# EAGLE design soraduino (EAGLE 6.2)
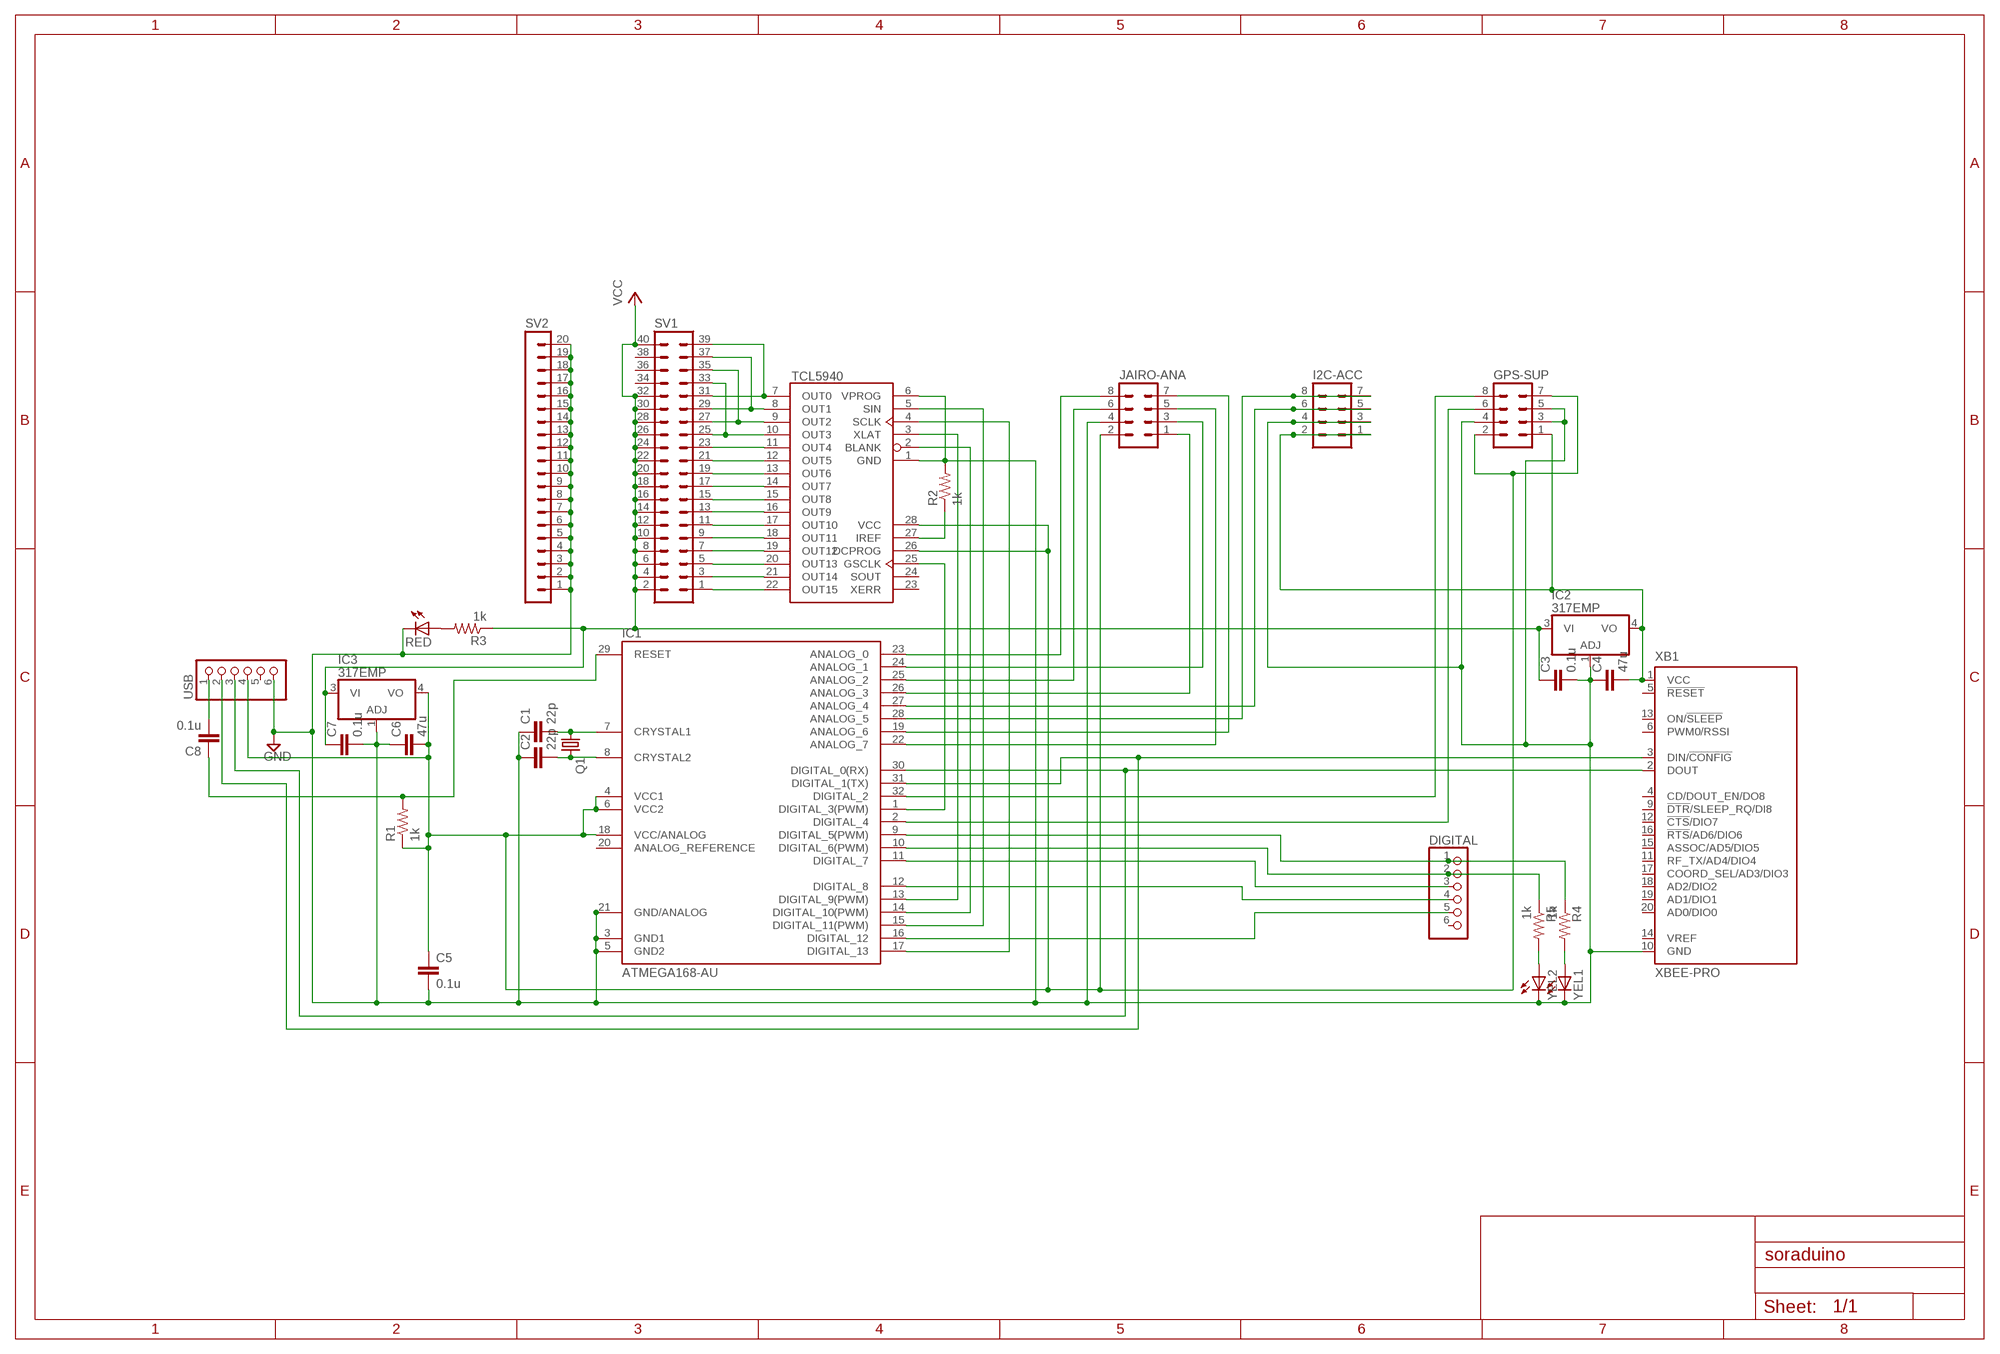
[diagram p0: schematic, sheet 1]

## Parts
C1  22p  C-EU050-024X044  [C050-024X044]
C2  22p  C-EU050-024X044  [C050-024X044]
C3  0.1u  C-EUC0805K  [C0805K]
C4  47u  C-EUC0805K  [C0805K]
C5  0.1u  C-EUC0805K  [C0805K]
C6  47u  C-EUC0805K  [C0805K]
C7  0.1u  C-EUC0805K  [C0805K]
C8  0.1u  C-EUC0805K  [C0805K]
DIGITAL  PINHD-1X6  [1X06]
GPS-SUP  MA04-2  [MA04-2]
I2C-ACC  MA04-2  [MA04-2]
IC1  ATMEGA168-AU  [TQFP32-08]
IC2  317EMP  [SOT223]
IC3  317EMP  [SOT223]
IC4  TCL5940SOP  [HTSSOP28PIN]
JAIRO-ANA  MA04-2  [MA04-2]
Q1  CRYSTALHC49S  [HC49/S]
R1  1k  R-US_R0603  [R0603]
R2  1k  R-US_R0603  [R0603]
R3  1k  R-US_R0603  [R0603]
R4  1k  R-US_R0603  [R0603]
R5  1k  R-US_R0603  [R0603]
RED  LEDCHIPLED_1206  [CHIPLED_1206]
SV1  MA20-2  [MA20-2]
SV2  MA20-1  [MA20-1]
USB  PINHD-1X6  [1X06]
XB1  XBEE-PRO  [XBEE-PRO]
YEL1  LEDCHIPLED_1206  [CHIPLED_1206]
YEL2  LEDCHIPLED_1206  [CHIPLED_1206]

## Nets
GND: C1.1 C2.1 C3.2 C4.1 C5.2 C6.1 C7.2 GPS-SUP.3 GPS-SUP.4 GPS-SUP.5 I2C-ACC.3 I2C-ACC.4 IC1.3(GND1) IC1.5(GND2) IC1.21(GND/ANALOG) IC2.1(ADJ) IC3.1(ADJ) IC4.1(GND) IC4.6(VPROG) JAIRO-ANA.4 R2.2 RED.C SV2.1 SV2.2 SV2.3 SV2.4 SV2.5 SV2.6 SV2.7 SV2.8 SV2.9 SV2.10 SV2.11 SV2.12 SV2.13 SV2.14 SV2.15 SV2.16 SV2.17 SV2.18 SV2.19 SV2.20 USB.6 XB1.10(GND) YEL1.C YEL2.C
N$1: C8.2 USB.1
N$2: C8.1 IC1.29(RESET) R1.2
N$3: IC1.30(DIGITAL_0(RX)) USB.3 XB1.2(DOUT)
N$4: C1.2 IC1.7(CRYSTAL1) Q1.1
N$5: C2.2 IC1.8(CRYSTAL2) Q1.2
N$6: C4.2 GPS-SUP.1 I2C-ACC.1 I2C-ACC.2 IC2.4(VO) XB1.1(VCC)
N$7: C5.1 C6.2 GPS-SUP.2 GPS-SUP.7 IC1.4(VCC1) IC1.6(VCC2) IC1.18(VCC/ANALOG) IC3.4(VO) IC4.26(DCPROG) IC4.28(VCC) JAIRO-ANA.2 R1.1 USB.4
N$8: IC4.8(OUT1) SV1.29 SV1.37
N$9: IC4.7(OUT0) SV1.31 SV1.39
N$10: R3.2 RED.A
N$11: IC4.9(OUT2) SV1.27 SV1.35
N$12: IC4.10(OUT3) SV1.25 SV1.33
N$13: IC4.11(OUT4) SV1.23
N$14: IC4.12(OUT5) SV1.21
N$15: IC4.13(OUT6) SV1.19
N$16: IC4.14(OUT7) SV1.17
N$17: IC4.15(OUT8) SV1.15
N$18: IC4.16(OUT9) SV1.13
N$19: IC4.17(OUT10) SV1.11
N$20: IC4.18(OUT11) SV1.9
N$21: IC4.19(OUT12) SV1.7
N$22: IC4.20(OUT13) SV1.5
N$23: IC4.21(OUT14) SV1.3
N$24: IC4.22(OUT15) SV1.1
N$25: IC1.25(ANALOG_2) JAIRO-ANA.6
N$26: IC1.1(DIGITAL_3(PWM)) IC4.25(GSCLK)
N$27: IC1.13(DIGITAL_9(PWM)) IC4.3(XLAT)
N$28: IC1.14(DIGITAL_10(PWM)) IC4.2(BLANK)
N$29: IC1.15(DIGITAL_11(PWM)) IC4.5(SIN)
N$30: IC1.17(DIGITAL_13) IC4.4(SCLK)
N$31: I2C-ACC.7 I2C-ACC.8 IC1.28(ANALOG_5)
N$32: I2C-ACC.5 I2C-ACC.6 IC1.27(ANALOG_4)
N$33: IC1.31(DIGITAL_1(TX)) USB.2 XB1.3(DIN/!CONFIG)
N$34: IC1.23(ANALOG_0) JAIRO-ANA.8
N$35: IC1.24(ANALOG_1) JAIRO-ANA.3
N$36: GPS-SUP.8 IC1.32(DIGITAL_2)
N$37: GPS-SUP.6 IC1.2(DIGITAL_4)
N$38: IC4.27(IREF) R2.1
N$39: DIGITAL.1 IC1.9(DIGITAL_5(PWM)) R4.1
N$40: DIGITAL.2 IC1.10(DIGITAL_6(PWM)) R5.1
N$41: DIGITAL.3 IC1.11(DIGITAL_7)
N$42: DIGITAL.4 IC1.12(DIGITAL_8)
N$43: IC1.26(ANALOG_3) JAIRO-ANA.1
N$44: IC1.19(ANALOG_6) JAIRO-ANA.7
N$45: IC1.22(ANALOG_7) JAIRO-ANA.5
N$46: R4.2 YEL1.A
N$47: DIGITAL.5 IC1.16(DIGITAL_12)
N$48: R5.2 YEL2.A
VCC: C3.1 C7.1 IC2.3(VI) IC3.3(VI) R3.1 SV1.2 SV1.4 SV1.6 SV1.8 SV1.10 SV1.12 SV1.14 SV1.16 SV1.18 SV1.20 SV1.22 SV1.24 SV1.26 SV1.28 SV1.30 SV1.32 SV1.40
Unconnected: DIGITAL.6 IC1.20(ANALOG_REFERENCE) IC4.23(XERR) IC4.24(SOUT) SV1.34 SV1.36 SV1.38 USB.5 XB1.4(CD/DOUT_EN/DO8) XB1.5(!RESET) XB1.6(PWM0/RSSI) XB1.9(!DTR!/SLEEP_RQ/DI8) XB1.11(RF_TX/AD4/DIO4) XB1.12(!CTS!/DIO7) XB1.13(ON/!SLEEP) XB1.14(VREF) XB1.15(ASSOC/AD5/DIO5) XB1.16(!RTS!/AD6/DIO6) XB1.17(COORD_SEL/AD3/DIO3) XB1.18(AD2/DIO2) XB1.19(AD1/DIO1) XB1.20(AD0/DIO0)

## Library data of the parts
C1 C2 = rcl:C-EU: CAPACITOR, European symbol
C3-C8 = resistor:C-EU: CAPACITOR, European symbol
DIGITAL USB = pinhead:PINHD-1X6: PIN HEADER
GPS-SUP I2C-ACC JAIRO-ANA = con-lstb:MA04-2: PIN HEADER; OC_FARNELL: unknown; OC_NEWARK: unknown
IC1 = Arduino-AVR:ATMEGA168
IC2 IC3 = linear:*317: Positive VOLTAGE REGULATOR
IC4 = tcl5940PWP:TCL5940: 16-Channel 12-Bit LED Driver
Q1 = crystal:CRYSTAL: CRYSTAL; OC_FARNELL: 1667008; OC_NEWARK: unknown
R1-R5 = rcl:R-US_: RESISTOR, American symbol
RED YEL1 YEL2 = led:LED: LED OSRAM: - CHIPLED LG R971, LG N971, LY N971, LG Q971, LY Q971, LO R971, LY R971 LH N974, LH R974 LS Q976, LO Q976, LY Q976 LO Q996 - Hyper CHIPLED LW Q18S LB Q993, LB Q99A, LB R99A - SideLED LS A670, LO A670, LY A670, LG A670, LP A670 LB A673, LV A673, LT A673, LW A673 LH A674 LY A675 LS A676, LA A676, LO A676, LY A676, LW A676 LS A679, LY A679, LG A679 - Hyper Micro SIDELED® LS Y876, LA Y876, LO Y876, LY Y876 LT Y87S - SmartLED LW L88C, LW L88S LB L89C, LB L89S, LG L890 LS L89K, LO L89K, LY L89K LS L896, LA L896, LO L896, LY L896 - TOPLED LS T670, LO T670, LY T670, LG T670, LP T670 LSG T670, LSP T670, LSY T670, LOP T670, LYG T670 LG T671, LOG T671, LSG T671 LB T673, LV T673, LT T673, LW T673 LH T674 LS T676, LA T676, LO T676, LY T676, LB T676, LH T676, LSB T676, LW T676 LB T67C, LV T67C, LT T67C, LS T67K, LO T67K, LY T67K, LW E67C LS E67B, LA E67B, LO E67B, LY E67B, LB E67C, LV E67C, LT E67C LW T67C LS T679, LY T679, LG T679 LS T770, LO T770, LY T770, LG T770, LP T770 LB T773, LV T773, LT T773, LW T773 LH T774 LS E675, LA E675, LY E675, LS T675 LS T776, LA T776, LO T776, LY T776, LB T776 LHGB T686 LT T68C, LB T68C - Hyper Mini TOPLED® LB M676 - Mini TOPLED Santana® LG M470 LS M47K, LO M47K, LY M47K Source: http://www.osram.convergy.de LUXEON: - LUMILED® LXK2-PW12-R00, LXK2-PW12-S00, LXK2-PW14-U00, LXK2-PW14-V00 LXK2-PM12-R00, LXK2-PM12-S00, LXK2-PM14-U00 LXK2-PE12-Q00, LXK2-PE12-R00, LXK2-PE12-S00, LXK2-PE14-T00, LXK2-PE14-U00 LXK2-PB12-K00, LXK2-PB12-L00, LXK2-PB12-M00, LXK2-PB14-N00, LXK2-PB14-P00, LXK2-PB14-Q00 LXK2-PR12-L00, LXK2-PR12-M00, LXK2-PR14-Q00, LXK2-PR14-R00 LXK2-PD12-Q00, LXK2-PD12-R00, LXK2-PD12-S00 LXK2-PH12-R00, LXK2-PH12-S00 LXK2-PL12-P00, LXK2-PL12-Q00, LXK2-PL12-R00 Source: www.luxeon.com KINGBRIGHT: KA-3528ASYC Source: www.kingbright.com
SV1 = con-lstb:MA20-2: PIN HEADER; OC_FARNELL: unknown; OC_NEWARK: unknown
SV2 = con-lstb:MA20-1: PIN HEADER; OC_FARNELL: unknown; OC_NEWARK: unknown
XB1 = maxstream:XBEE: XBee (TM) /XBee-PRO(TM) OEM RF Modules Source: MaxStream, Inc. xbee_productmanual.pdf; MPN: XBP24-AWI-001; OC_FARNELL: 1337916; OC_NEWARK: 42M2667

## Board
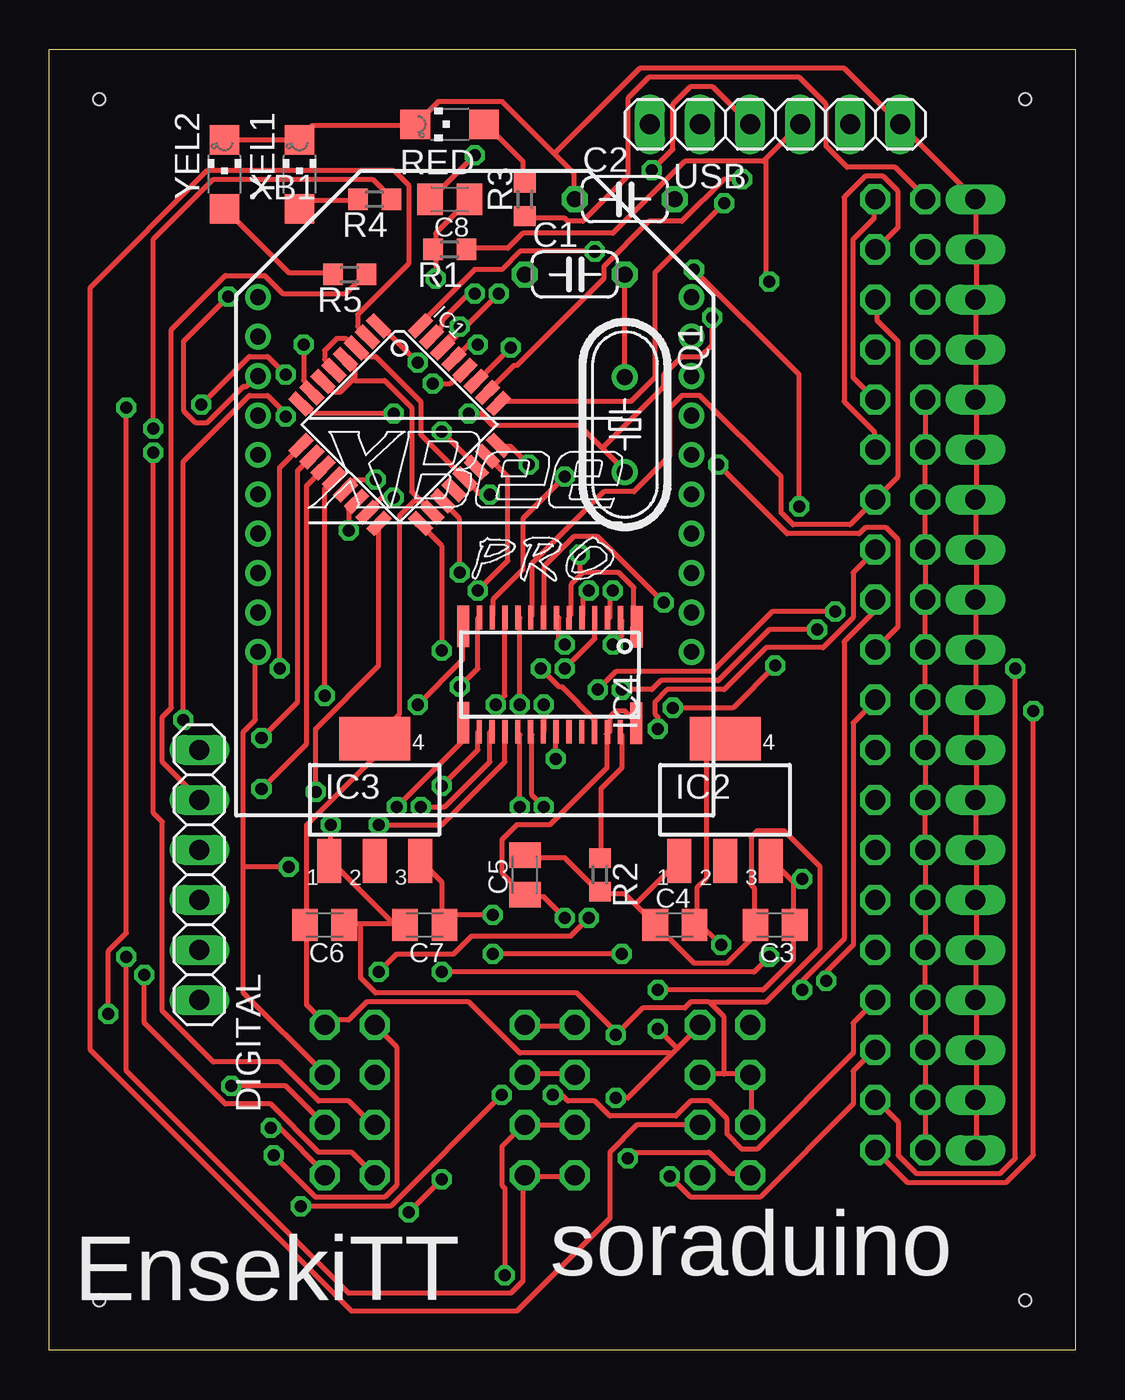
[diagram p1: board, top side]
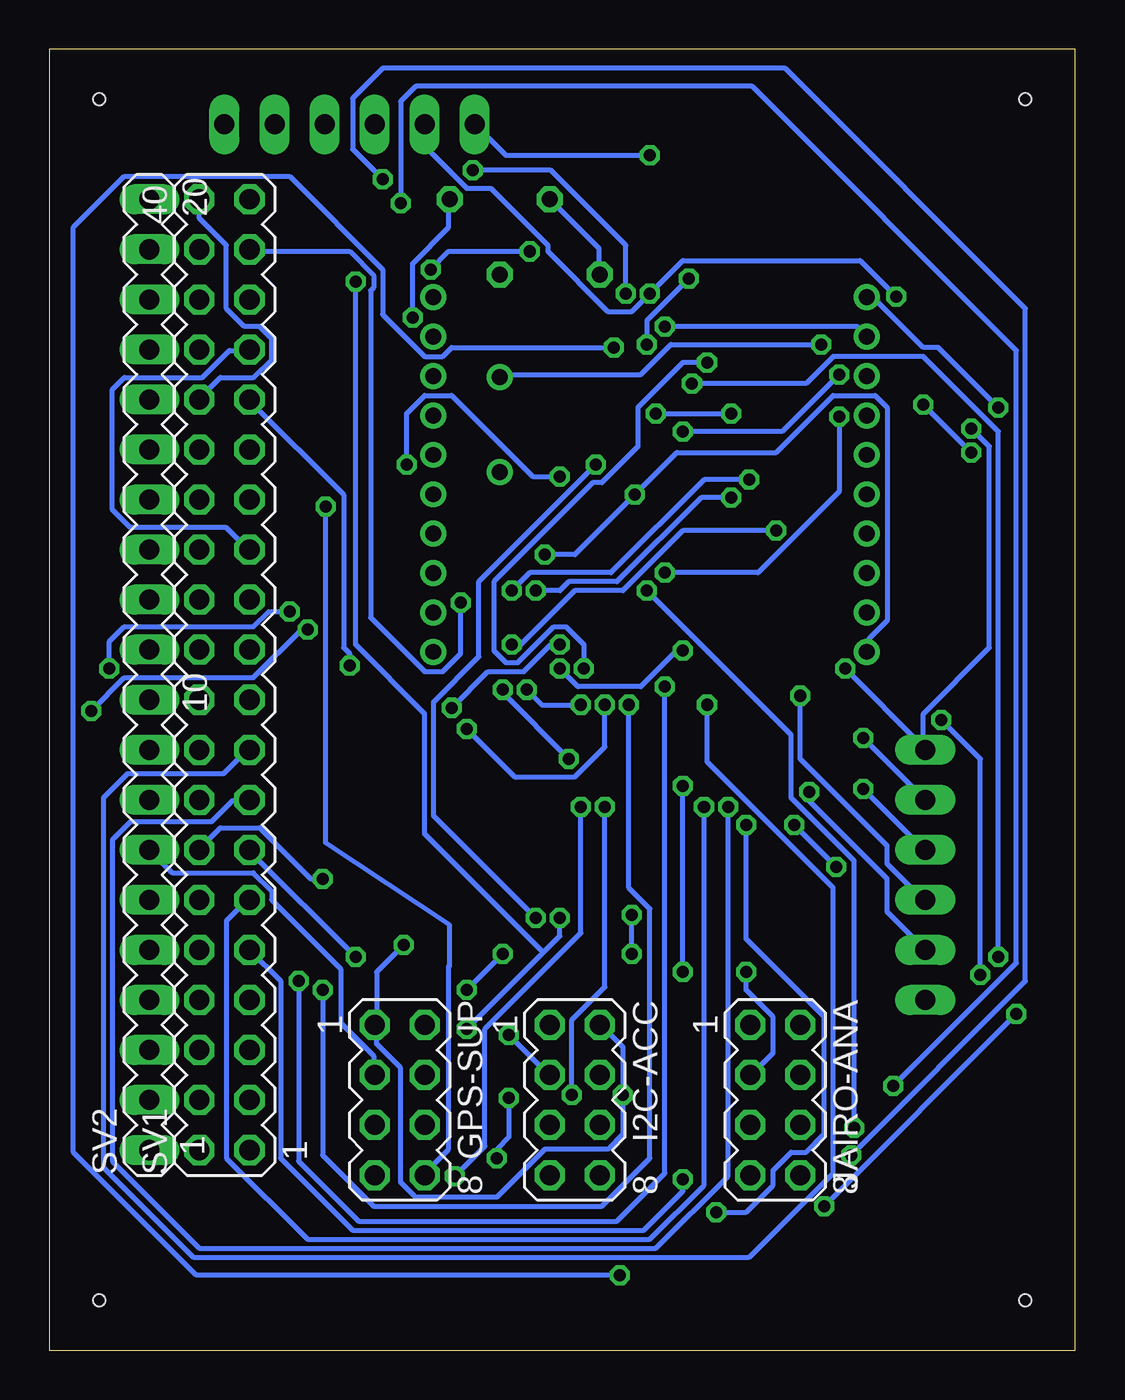
[diagram p2: board, bottom side, seen from below]

Size 52.07 x 66.04 mm. Coordinates in mm from the lower left corner, seen from the top.
Outline: 0,66.04 52.07,66.04 52.07,0 0,0 0,66.04
Copper layers (1*16): Top 0.035mm / dielectric 1.5mm / Bottom 0.035mm
Design rules: minimum track width 10mil, minimum drill 24mil, track to track 8mil, track to pad 8mil, pad to pad 8mil, via to via 8mil, smd to smd 8mil, copper to edge 40mil, drill to drill 8mil, minimum pad ring 10mil, minimum via ring 8mil, stop-mask expansion 4mil, vias tented up to drill 0mil, thermal gap 10mil
Holes 0.6 mm at 2.54,63.5 49.53,63.5 49.53,2.54 2.54,2.54

### Footprints (pad centres in the part's own frame; a part is rotated, then mirrored left to right if it is on the bottom)
C050-024X044 = drill 0.813 octagon: 1 -2.54,0; 2 2.54,0
C0805K = smd 1.3 x 1.6: 1 -1,0; 2 1,0
1X06 = drill 1.016 long: 1 -6.35,0; 2 -3.81,0; 3 -1.27,0; 4 1.27,0; 5 3.81,0; 6 6.35,0
MA04-2 = drill 1.016 octagon: 1 -3.81,-1.27; 2 -3.81,1.27; 3 -1.27,-1.27; 4 -1.27,1.27; 5 1.27,-1.27; 6 1.27,1.27; 7 3.81,-1.27; 8 3.81,1.27
TQFP32-08 = smd 1.27 x 0.559: 1 -4.293,2.8; 2 -4.293,2; 3 -4.293,1.2; 4 -4.293,0.4; 5 -4.293,-0.4; 6 -4.293,-1.2; 7 -4.293,-2; 8 -4.293,-2.8; 17 4.293,-2.8; 18 4.293,-2; 19 4.293,-1.2; 20 4.293,-0.4; 21 4.293,0.4; 22 4.293,1.2; 23 4.293,2; 24 4.293,2.8 | smd 0.559 x 1.27: 9 -2.8,-4.293; 10 -2,-4.293; 11 -1.2,-4.293; 12 -0.4,-4.293; 13 0.4,-4.293; 14 1.2,-4.293; 15 2,-4.293; 16 2.8,-4.293; 25 2.8,4.293; 26 2,4.293; 27 1.2,4.293; 28 0.4,4.293; 29 -0.4,4.293; 30 -1.2,4.293; 31 -2,4.293; 32 -2.8,4.293
SOT223 = smd 1.219 x 2.235: 1 -2.311,-3.099; 2 0,-3.099; 3 2.311,-3.099 | smd 3.6 x 2.2: 4 0,3.099
HTSSOP28PIN = smd 0.61 x 2.1: 1 -4.395,-2.45; 14 4.395,-2.45; 15 4.395,2.45; 28 -4.395,2.45 | smd 0.27 x 1.2: 2 -3.575,-2.9; 3 -2.925,-2.9; 4 -2.275,-2.9; 5 -1.625,-2.9; 6 -0.975,-2.9; 7 -0.325,-2.9; 8 0.325,-2.9; 9 0.975,-2.9; 10 1.625,-2.9; 11 2.275,-2.9; 12 2.925,-2.9; 13 3.575,-2.9; 16 3.575,2.9; 17 2.925,2.9; 18 2.275,2.9; 19 1.625,2.9; 20 0.975,2.9; 21 0.325,2.9; 22 -0.325,2.9; 23 -0.975,2.9; 24 -1.625,2.9; 25 -2.275,2.9; 26 -2.925,2.9; 27 -3.575,2.9
HC49/S = drill 0.813: 1 -2.413,0; 2 2.413,0
R0603 = smd 1 x 1.1: 1 -0.85,0; 2 0.85,0
CHIPLED_1206 = smd 1.5 x 1.5: A 0,-1.75; C 0,1.75
MA20-2 = drill 1.016 octagon: 1 -24.13,-1.27; 2 -24.13,1.27; 3 -21.59,-1.27; 4 -21.59,1.27; 5 -19.05,-1.27; 6 -19.05,1.27; 7 -16.51,-1.27; 8 -16.51,1.27; 9 -13.97,-1.27; 10 -13.97,1.27; 11 -11.43,-1.27; 12 -11.43,1.27; 13 -8.89,-1.27; 14 -8.89,1.27; 15 -6.35,-1.27; 16 -6.35,1.27; 17 -3.81,-1.27; 18 -3.81,1.27; 19 -1.27,-1.27; 20 -1.27,1.27; 21 1.27,-1.27; 22 1.27,1.27; 23 3.81,-1.27; 24 3.81,1.27; 25 6.35,-1.27; 26 6.35,1.27; 27 8.89,-1.27; 28 8.89,1.27; 29 11.43,-1.27; 30 11.43,1.27; 31 13.97,-1.27; 32 13.97,1.27; 33 16.51,-1.27; 34 16.51,1.27; 35 19.05,-1.27; 36 19.05,1.27; 37 21.59,-1.27; 38 21.59,1.27; 39 24.13,-1.27; 40 24.13,1.27
MA20-1 = drill 1.016 long: 1 -24.13,0; 2 -21.59,0; 3 -19.05,0; 4 -16.51,0; 5 -13.97,0; 6 -11.43,0; 7 -8.89,0; 8 -6.35,0; 9 -3.81,0; 10 -1.27,0; 11 1.27,0; 12 3.81,0; 13 6.35,0; 14 8.89,0; 15 11.43,0; 16 13.97,0; 17 16.51,0; 18 19.05,0; 19 21.59,0; 20 24.13,0
XBEE-PRO = drill 0.8 pad 1.27: 1 -11,9; 2 -11,7; 3 -11,5; 4 -11,3; 5 -11,1; 6 -11,-1; 7 -11,-3; 8 -11,-5; 9 -11,-7; 10 -11,-9; 11 11,-9; 12 11,-7; 13 11,-5; 14 11,-3; 15 11,-1; 16 11,1; 17 11,3; 18 11,5; 19 11,7; 20 11,9

### Placement (x,y rotation side)
C1  26.67,54.61 0 top
C2  29.21,58.42 0 top
C3  36.83,21.59 180 top
C4  31.75,21.59 0 top
C5  24.13,24.13 90 top
C6  13.97,21.59 180 top
C7  19.05,21.59 180 top
C8  20.32,58.42 180 top
DIGITAL  7.62,24.13 270 top
GPS-SUP  34.29,12.7 270 bottom
I2C-ACC  25.4,12.7 270 bottom
IC1  17.78,46.99 315.1 top
IC2  34.29,27.94 0 top
IC3  16.51,27.94 0 top
IC4  25.4,34.29 179.9 top
JAIRO-ANA  15.24,12.7 270 bottom
Q1  29.21,46.99 270 top
R1  20.32,55.88 180 top
R2  27.94,24.13 270 top
R3  24.13,58.42 90 top
R4  16.51,58.42 180 top
R5  15.24,54.61 180 top
RED  20.32,62.23 90 top
SV1  43.18,34.29 90 bottom
SV2  46.99,34.29 90 bottom
USB  36.83,62.23 0 top
XB1  21.59,44.45 0 top
YEL1  12.7,59.69 0 top
YEL2  8.89,59.69 0 top

### Tracks (layer width: path | path; a pad name or v marks a point on that pad's centre or on a via)
GND  (via drill 0.61)
  Top 0.254: 9.86,24.54 9.86,18.14 13.97,14.02 JAIRO-ANA.4 | 9.86,24.54 9.86,31.39 10.47,32 10.47,35.36 XB1.10 | 27,39.39 27.08,39.47 28.91,39.47 29.67,38.71 29.67,36.88 IC4.1 | 27,39.39 26.47,38.86 26.47,37.34 IC4.6 | IC1.5 14.43,49.84 13.97,50.29 13.97,50.75 14.58,51.36 15.04,51.36 15.49,50.9 IC1.3 15.65,50.75 15.95,50.44 16.56,50.44 18.85,48.16 18.85,46.48 20.98,44.35 IC1.21 21.13,44.2 21.89,43.43 v22.35,43.43 | v26.92,40.39 26.92,39.47 27,39.39 | 29.74,22.63 30.73,21.64 C4.1 32.16,20.22 32.72,19.66 34.39,19.66 35.76,21.03 35.76,21.49 C3.2 35.76,21.64 35.76,23.47 35.61,23.62 35.61,26.06 35.92,26.36 37.29,26.36 39.12,24.54 39.12,20.42 36.37,17.68 33.63,17.68 33.55,17.6 | 29.74,22.63 29.21,23.17 27.99,23.17 R2.2 27.84,23.32 26.16,24.99 24.18,24.99 C5.2 | 29.74,22.63 31.95,24.84 IC2.1 | 17.47,21.64 17.93,21.64 C7.2 17.47,21.64 | 17.47,21.64 15.8,21.64 | 15.8,21.64 15.04,21.64 C6.1 | 17.47,21.64 14.28,24.84 | I2C-ACC.4 24.18,14.02 26.62,14.02 I2C-ACC.3 | 34.24,14.02 35.46,14.02 GPS-SUP.3 35.61,13.87 35.61,11.43 GPS-SUP.5 | 34.24,14.02 33.02,14.02 GPS-SUP.4 | 33.55,17.6 34.24,16.92 34.24,14.02 | 33.55,17.6 33.48,17.68 32.56,17.68 32.26,17.37 30.12,17.37 v28.75,16 28.75,16.15 26.77,18.14 16.56,18.14 15.8,18.9 15.8,21.64 | YEL2.C 8.94,61.42 12.6,61.42 YEL1.C 12.75,61.57 13.36,62.18 18.54,62.18 RED.C 18.69,62.33 19.76,63.4 22.96,63.4 25.63,60.73 | 25.63,60.73 26.62,59.74 26.62,58.52 C2.1 | 47.04,53.34 47.04,55.78 SV2.19 47.04,55.93 47.04,58.37 SV2.20 USB.6 40.33,65.08 29.97,65.08 25.63,60.73 | 47.04,38.1 47.04,40.54 SV2.13 47.04,40.69 47.04,43.13 SV2.14 47.04,43.28 47.04,45.72
  Top 0.254: 47.04,45.72 47.04,48.16 SV2.16 47.04,48.31 47.04,50.75 SV2.17 47.04,50.9 47.04,53.34 | 47.04,45.72 SV2.15 | SV2.1 47.04,10.21 47.04,12.65 SV2.2 47.04,12.8 47.04,15.24 | 47.04,15.24 47.04,17.68 SV2.4 47.04,17.83 47.04,20.27 SV2.5 47.04,20.42 47.04,22.86 | 47.04,15.24 SV2.3 | 47.04,22.86 47.04,25.3 SV2.7 47.04,25.45 47.04,27.89 SV2.8 47.04,28.04 47.04,30.48 | 47.04,30.48 47.04,32.92 SV2.10 47.04,33.07 47.04,35.51 SV2.11 47.04,35.66 47.04,38.1 | 47.04,30.48 SV2.9 | 47.04,22.86 SV2.6 | 47.04,38.1 SV2.12 | 47.04,53.34 SV2.18 | v12.14,24.54 9.86,24.54 | 14.28,24.84 v14.28,26.67 | 14.28,24.84 IC3.1
  Bottom 0.254: v26.92,40.39 25.4,40.39 v22.35,43.43 20.22,45.57 15.19,45.57 12.29,48.46 10.16,48.46 9.55,47.85 9.55,37.03 10.47,36.12 10.47,35.51 XB1.10 | v28.75,16 26.77,14.02 I2C-ACC.3 | C2.1 24.18,55.93 24.18,54.71 C1.1 | SV2.7 45.82,24.23 41.71,24.23 40.79,23.32 40.79,22.86 37.29,19.36 37.29,16.61 35.61,14.93 35.61,14.02 GPS-SUP.3 | v14.28,26.67 v12.14,24.54
N$1  (via drill 0.61)
  Top 0.254: v21.59,60.66 19.46,58.52 C8.2
  Bottom 0.254: v21.59,60.66 28.91,60.66 USB.1
N$2  (via drill 0.61)
  Top 0.254: C8.1 21.28,58.37 19.61,56.69 19.61,55.93 R1.2 19.61,55.78 v19.61,54.41 | v21.74,51.05 21.28,51.05 20.68,50.44 IC1.29
  Bottom 0.254: v21.74,51.05 21.74,52.27 v19.61,54.41
N$3  (via drill 0.61)
  Top 0.254: 20.07,50.9 20.07,51.21 v20.83,51.97 | USB.3 33.63,64.16 32.56,64.16 31.65,63.25 31.65,60.96 v30.58,59.89 | 20.07,50.9 v22.81,53.64 | 20.07,50.9 IC1.30
  Bottom 0.254: v20.83,51.97 11.07,51.97 10.62,51.51 XB1.2 | v30.58,59.89 26.62,59.89 22.81,56.08 v22.81,53.64
N$4  (via drill 0.61)
  Top 0.254: v12.9,51.05 12.9,49.23 13.21,48.92 13.21,48.62 IC1.7 | Q1.1 C1.2
  Bottom 0.254: v12.9,51.05 20.52,51.05 22.05,49.53 29.21,49.53 Q1.1
N$5  (via drill 0.61)
  Top 0.254: v17.47,47.55 13.36,47.55 12.9,48.01 IC1.8 | v21.28,47.55 21.89,47.55 22.5,46.94 26.92,46.94 28.07,45.8 | 28.07,45.8 29.21,44.65 Q1.2 | v33.63,52.43 33.63,51.05 33.02,50.44 32.11,50.44 31.19,49.53 31.19,48.92 28.07,45.8
  Bottom 0.254: v21.28,47.55 v17.47,47.55 | v33.63,52.43 33.63,55.17 31.8,57 31.8,58.37 C2.2
N$6  (via drill 0.61)
  Top 0.254: 32.87,21.79 32.87,23.47 33.33,23.93 33.33,30.02 34.24,30.94 IC2.4 | 32.87,21.79 32.87,21.64 C4.2 32.87,21.79 | 32.87,21.79 v34.09,20.57 | v3.91,47.85 3.91,21.18 3,20.27 v3,17.07 | v12.75,7.31 17.32,7.31 v22.96,12.95 | I2C-ACC.1 26.62,16.46 24.18,16.46 I2C-ACC.2
  Bottom 0.254: v34.09,20.57 35.46,19.2 35.46,16.61 GPS-SUP.1 35.46,16.46 35.46,15.54 34.24,14.33 34.24,8.53 33.48,7.77 29.36,7.77 26.92,10.21 23.72,10.21 22.96,10.97 v22.96,12.95 22.96,15.39 24.03,16.46 I2C-ACC.2 | v3.91,47.85 6.96,50.9 7.72,50.9 10.16,53.34 10.47,53.34 XB1.1 | v12.75,7.31 v3,17.07
N$7  (via drill 0.61)
  Top 0.254: 15.42,49.3 15.49,49.38 15.49,49.84 15.04,50.29 IC1.4 | 15.42,49.3 14.73,48.62 14.43,48.62 13.97,49.07 IC1.6 | 18.77,43.2 18.39,43.59 18.39,47.85 17.02,49.23 15.49,49.23 15.42,49.3 | 18.77,43.2 19.3,42.67 IC1.18 | 18.77,43.2 18.69,43.13 18.54,43.13 17.78,42.37 17.78,32.31 16.56,31.09 IC3.4 16.41,30.94 16.41,30.02 13.06,26.67 13.06,21.64 C6.2 13.06,21.49 13.06,17.53 13.97,16.61 JAIRO-ANA.2 13.97,16.76 15.19,16.76 16.1,17.68 21.28,17.68 23.88,15.09 31.5,15.09 31.57,15.01 | USB.4 36.3,60.43 | 36.3,60.43 36.22,60.35 32.26,60.35 28.6,56.69 24.03,56.69 23.27,55.93 21.28,55.93 R1.1 | IC4.28 29.82,31.85 29.21,32.46 28.75,32.46 28.45,32.16 28.45,31.39 IC4.26 28.3,31.24 28.3,29.57 25.4,26.67 23.72,26.67 22.96,25.91 22.96,24.23 24.03,23.17 C5.1 24.18,23.01 25.09,23.01 v26.16,21.95 | v29.36,9.75 29.67,10.06 33.48,10.06 34.54,8.99 35.46,8.99 GPS-SUP.7 | v28.75,12.8 29.36,12.8 31.57,15.01 | 31.88,15.32 33.02,16.46 GPS-SUP.2 | 31.88,15.32 31.57,15.01 | 31.88,15.32 v30.89,16.31 | v36.53,54.25 36.37,54.41 36.37,60.35 36.3,60.43
  Bottom 0.254: v29.36,9.75 29.36,10.21 28.75,10.82 v28.75,12.8 | v26.16,21.95 26.16,21.03 27,20.19 | v30.89,16.31 27,20.19 | v36.53,54.25 36.53,35.81 33.02,32.31 33.02,26.21 27,20.19
N$8  (via drill 0.61)
  Top 0.254: v31.19,37.95 27.84,41.3 26.62,41.3 25.09,39.78 25.09,37.34 IC4.8 | SV1.29 41.86,45.72 41.86,46.63 40.33,48.16 40.33,58.52 41.4,59.59 42.32,59.59 43.08,58.83 43.08,57 42.01,55.93 SV1.37
  Bottom 0.254: v31.19,37.95 31.19,35.36 32.11,34.44 33.02,34.44 35.76,37.19 35.76,53.8 35.61,53.95 35.61,54.56 36.83,55.78 41.86,55.78 SV1.37
N$9  (via drill 0.61)
  Top 0.254: v26.16,35.81 25.86,36.12 25.86,37.19 IC4.7 | v31.65,32.61 34.7,32.61 v36.83,34.75 | SV1.31 40.79,49.38 40.79,56.39 41.86,57.45 41.86,58.37 SV1.39
  Bottom 0.254: v26.16,35.81 26.62,35.81 27.99,34.44 29.82,34.44 v31.65,32.61 | v36.83,34.75 36.83,35.36 37.14,35.66 37.14,43.43 41.86,48.16 SV1.31
N$10
  Top 0.254: R3.2 24.03,59.28 24.03,60.35 22.2,62.18 RED.A
N$11
  Top 0.254: IC4.9 24.49,37.34 24.49,39.93 28.14,43.59 29.67,43.59 31.5,45.42 31.5,47.85 32.11,48.46 33.02,48.46 37.14,44.35 37.14,42.52 37.74,41.91 40.64,41.91 SV1.27 43.08,44.35 43.08,51.21 42.01,52.27 42.01,53.34 SV1.35
N$12  (via drill 0.61)
  Top 0.254: v23.88,32.77 23.88,37.19 IC4.10 | v30.89,31.55 30.89,32.16 30.73,32.31 30.73,32.92 31.34,33.53 34.24,33.53 36.37,35.66 39.27,35.66 40.79,37.19 40.79,39.47 41.86,40.54 SV1.25
  Bottom 0.254: v23.88,32.77 23.88,30.63 25.4,29.11 28.45,29.11 v30.89,31.55 | SV1.33 42.01,50.75 42.93,50.75 44.3,49.38 48.26,49.38 48.87,48.77 48.87,42.67 47.95,41.76 43.08,41.76 42.01,40.69 SV1.25
N$13  (via drill 0.61)
  Top 0.254: v22.66,32.77 23.11,33.22 23.11,37.19 IC4.11 | v38.2,18.29 38.2,18.75 40.33,20.88 40.33,35.97 41.86,37.49 41.86,38.1 SV1.23
  Bottom 0.254: v22.66,32.77 22.66,23.47 21.59,22.4 21.59,9.75 24.03,7.31 35.61,7.31 38.2,9.91 v38.2,18.29
N$14  (via drill 0.61)
  Top 0.254: v26.16,44.35 24.03,42.22 24.03,39.62 22.5,38.1 22.5,37.34 IC4.12 | v33.93,44.96 37.44,41.45 41.1,41.45 41.4,41.76 42.47,41.76 43.08,41.15 43.08,36.73 SV1.21
  Bottom 0.254: v26.16,44.35 27.53,44.35 31.65,48.46 33.02,48.46 33.93,47.55 v33.93,44.96
N$15  (via drill 0.61)
  Top 0.254: v20.83,33.68 21.74,34.59 21.74,37.19 IC4.13 | v39.42,18.75 39.42,19.2 40.79,20.57 40.79,31.85 41.86,32.92 SV1.19
  Bottom 0.254: v20.83,33.68 20.83,8.99 23.27,6.55 36.37,6.55 39.42,9.6 v39.42,18.75
N$16  (via drill 0.61)
  Top 0.254: v18.69,32.77 20.98,35.05 20.98,36.73 IC4.14
  Bottom 0.254: v18.69,32.77 18.69,29.87 12.29,23.47 12.29,8.99 16.56,4.72 44.75,4.72 49.33,9.3 49.33,28.04 48.11,29.26 43.23,29.26 42.01,30.48 SV1.17
N$17  (via drill 0.61)
  Top 0.254: v17.63,27.58 20.98,30.94 20.98,31.7 IC4.15
  Bottom 0.254: v17.63,27.58 17.63,8.84 21.28,5.18 44.45,5.18 48.87,9.6 48.87,25.91 47.95,26.82 43.84,26.82 42.77,27.89 42.01,27.89 SV1.15
N$18  (via drill 0.61)
  Top 0.254: v19.91,28.65 21.74,30.48 21.74,31.39 IC4.16 | v19.91,19.2 35.76,19.2 v36.53,19.96
  Bottom 0.254: v19.91,19.2 v19.91,28.65 | v36.53,19.96 41.86,25.3 SV1.13
N$19  (via drill 0.61)
  Top 0.254: v18.85,27.58 20.07,27.58 22.35,29.87 22.35,31.39 IC4.17
  Bottom 0.254: v18.85,27.58 18.85,8.38 21.59,5.64 38.96,5.64 43.08,9.75 43.08,21.79 42.01,22.86 SV1.11
N$20  (via drill 0.61)
  Top 0.254: v16.71,26.67 19.91,26.67 23.11,29.87 23.11,31.24 IC4.18 | v19.91,8.69 v18.24,7.01
  Bottom 0.254: v16.71,26.67 16.71,20.88 12.75,16.92 12.75,10.97 13.67,10.06 14.43,10.06 15.34,9.14 15.34,8.38 16.71,7.01 v18.24,7.01 | v19.91,8.69 19.91,8.08 21.89,6.1 36.68,6.1 40.33,9.75 40.33,18.75 SV1.9
N$21  (via drill 0.61)
  Top 0.254: v23.88,27.58 23.88,31.24 IC4.19 | v25.55,12.95 26.01,12.95 26.31,12.65 27.69,12.65 28.45,11.89 31.8,11.89 32.56,12.65 33.48,12.65 34.39,11.73 34.39,10.97 35.15,10.21 35.92,10.21 40.79,15.09 40.79,16.61 41.86,17.68 SV1.7
  Bottom 0.254: v23.88,27.58 23.88,18.44 25.55,16.76 v25.55,12.95
N$22  (via drill 0.61)
  Top 0.254: v25.09,27.58 24.49,28.19 24.49,31.24 IC4.20 | v31.5,8.84 32.56,7.77 36.07,7.77 40.79,12.5 40.79,14.17 41.86,15.24 SV1.5
  Bottom 0.254: v25.09,27.58 25.09,21.18 29.97,16.31 29.97,10.36 v31.5,8.84
N$23  (via drill 0.61)
  Top 0.254: v25.09,32.77 25.09,31.39 IC4.21 | v27.84,33.53 28.75,34.44 33.63,34.44 36.68,37.49 v39.88,37.49 | v49.02,34.59 49.02,9.75 48.26,8.99 43.99,8.99 43.08,9.91 43.08,11.58 42.01,12.65 SV1.3
  Bottom 0.254: v25.09,32.77 27.08,32.77 v27.84,33.53 | v39.88,37.49 40.95,37.49 41.71,36.73 48.26,36.73 49.02,35.97 v49.02,34.59
N$24  (via drill 0.61)
  Top 0.254: v25.7,30.02 25.7,31.24 IC4.22 | v29.06,33.53 30.58,33.53 31.04,33.98 33.93,33.98 36.53,36.58 v38.96,36.58 | v49.94,32.46 49.94,9.91 48.56,8.53 43.54,8.53 SV1.1
  Bottom 0.254: v25.7,30.02 29.06,33.38 v29.06,33.53 | v38.96,36.58 39.27,36.58 41.71,34.14 48.26,34.14 v49.94,32.46
N$25  (via drill 0.61)
  Top 0.254: v34.24,58.22 30.73,54.71 30.73,49.38 29.52,48.16 22.81,48.16 IC1.25 | v9.25,13.41 11.99,13.41 JAIRO-ANA.6
  Bottom 0.254: v34.24,58.22 34.24,63.4 33.48,64.16 16.41,64.16 3,50.75 3,19.66 v9.25,13.41
N$26  (via drill 0.61)
  Top 0.254: v24.94,34.59 25.86,33.68 26.01,33.68 27.69,32 27.69,31.39 IC4.25 | v18.69,50.14 16.87,51.97 IC1.1
  Bottom 0.254: v24.94,34.59 24.94,35.81 25.86,36.73 26.47,36.73 28.3,34.9 28.91,34.9 29.52,35.51 29.52,39.01 24.49,44.04 24.03,44.04 22.2,45.87 22.2,47.85 19.91,50.14 v18.69,50.14
N$27  (via drill 0.61)
  Top 0.254: v28.6,38.56 28.45,38.41 28.45,37.19 IC4.3 | v16.56,44.2 15.49,44.2 15.04,43.74 IC1.13
  Bottom 0.254: v28.6,38.56 27.69,39.47 23.57,39.47 18.85,44.2 v16.56,44.2
N$28  (via drill 0.61)
  Top 0.254: v28.6,35.81 29.06,36.27 29.06,37.03 IC4.2 | v15.19,41.61 15.19,42.67 15.49,42.98 IC1.14
  Bottom 0.254: v28.6,35.81 28.14,35.81 25.4,38.56 22.96,38.56 19.91,41.61 v15.19,41.61
N$29  (via drill 0.61)
  Top 0.254: v27.38,38.56 27.08,38.25 27.08,37.34 IC4.5 | v17.47,43.28 16.87,43.28 16.26,42.67 IC1.15
  Bottom 0.254: v27.38,38.56 26.16,38.56 25.7,39.01 23.27,39.01 19,43.28 v17.47,43.28
N$30  (via drill 0.61)
  Top 0.254: v26.16,34.59 27.69,36.12 IC4.4 | v19.91,35.51 19.91,40.84 18.85,41.91 IC1.17
  Bottom 0.254: v26.16,34.59 25.25,33.68 22.05,33.68 20.22,35.51 v19.91,35.51
N$31  (via drill 0.61)
  Top 0.254: v19.46,49.07 20.37,49.07 20.98,49.68 IC1.28 | v3.91,19.96 3.91,14.17 15.19,2.9 23.42,2.9 24.03,3.5 24.03,8.84 I2C-ACC.8 24.18,8.84 26.62,8.84 I2C-ACC.7
  Bottom 0.254: v19.46,49.07 13.67,49.07 12.29,50.44 7.72,50.44 3.91,46.63 v3.91,19.96
N$32  (via drill 0.61)
  Top 0.254: v23.42,50.9 21.74,49.23 IC1.27 | v23.11,3.81 23.11,8.23 22.96,8.38 22.96,10.36 24.03,11.43 I2C-ACC.6 I2C-ACC.5
  Bottom 0.254: v23.42,50.9 31.65,50.9 32.11,50.44 33.02,50.44 35.15,52.58 35.15,54.86 39.88,59.59 48.26,59.59 50.85,57 50.85,10.06 44.6,3.81 v23.11,3.81
N$33  (via drill 0.61)
  Top 0.254: v21.59,53.64 21.28,53.64 19.91,52.27 19.91,51.97 19.46,51.51 IC1.31 | v9.09,53.49 6.81,51.21 6.81,47.7 7.42,47.09 8.03,47.09 9.86,48.92 10.01,48.92 10.47,49.38 XB1.3
  Bottom 0.254: USB.2 33.02,61.11 30.89,58.98 29.67,58.98 26.77,56.08 26.77,55.78 23.72,52.73 22.5,52.73 v21.59,53.64 19.91,55.32 10.92,55.32 v9.09,53.49
N$34  (via drill 0.61)
  Top 0.254: v21.74,38.56 23.27,40.08 23.27,44.35 22.35,45.26 IC1.23 | v11.23,11.28 11.68,11.28 13.97,8.99 JAIRO-ANA.8
  Bottom 0.254: v21.74,38.56 14.43,31.24 14.43,28.04 11.23,24.84 v11.23,11.28
N$35  (via drill 0.61)
  Top 0.254: v24.33,44.96 23.42,45.87 22.81,45.87 IC1.24 | v27.38,21.95 26.47,21.03 21.44,21.03 20.52,20.12 17.63,20.12 v16.71,19.2
  Bottom 0.254: v24.33,44.96 30.28,39.01 30.28,35.2 32.56,32.92 32.56,27.13 v27.38,21.95 | v16.71,19.2 16.71,18.29 15.34,16.92 15.34,15.09 16.41,14.02 JAIRO-ANA.3
N$36  (via drill 0.61)
  Top 0.254: v27.69,55.78 23.88,55.78 22.96,54.86 21.59,54.86 18.85,52.12 IC1.32 | v32.72,54.86 38.05,49.53 v38.05,42.82
  Bottom 0.254: v27.69,55.78 31.8,55.78 v32.72,54.86 | v38.05,42.82 38.05,25.76 31.75,21.59 31.75,19.51 31.8,19.51 31.8,10.21 33.02,8.99 GPS-SUP.8
N$37
  Top 0.254: GPS-SUP.6 29.82,11.43 28.45,10.06 28.45,6.71 23.72,1.98 15.34,1.98 2.08,15.24 2.08,53.95 8.03,59.89 17.47,59.89 18.24,59.13 18.24,55.17 15.65,52.58 15.65,51.97 16.1,51.51 IC1.2
N$38
  Top 0.254: R2.1 27.99,24.99 27.99,28.5 29.06,29.57 29.06,31.24 IC4.27
N$39  (via drill 0.61)
  Top 0.254: v5.28,46.79 5.28,56.39 8.33,59.44 16.41,59.44 17.32,58.52 R4.1 | v11.68,34.59 11.68,44.81 12.75,45.87 IC1.9
  Bottom 0.254: v5.28,46.79 4.37,45.87 4.37,35.66 7.72,32.31 7.72,30.63 | 7.72,30.63 7.72,30.48 DIGITAL.1 7.72,30.63 | 7.72,30.63 v11.68,34.59
N$40  (via drill 0.61)
  Top 0.254: R5.1 15.95,54.56 15.04,53.64 11.84,53.64 10.92,54.56 8.94,54.56 6.2,51.82 6.2,32.61 5.74,32.16 5.74,29.87 7.57,28.04 DIGITAL.2 | v10.77,31.09 12.6,32.92 12.6,44.65 13.21,45.26 IC1.10
  Bottom 0.254: DIGITAL.2 v10.77,31.09
N$41  (via drill 0.61)
  Top 0.254: v10.77,28.5 13.06,30.79 13.06,43.89 13.82,44.65 IC1.11
  Bottom 0.254: v10.77,28.5 7.72,25.45 DIGITAL.3
N$42  (via drill 0.61)
  Top 0.254: v13.97,33.22 13.97,43.74 14.43,44.2 IC1.12
  Bottom 0.254: v13.97,33.22 13.97,30.02 9.55,25.6 9.55,24.69 7.72,22.86 DIGITAL.4
N$43  (via drill 0.61)
  Top 0.254: v35.15,59.44 34.24,59.44 32.11,57.3 30.43,57.3 28.14,55.02 28.14,54.41 23.72,49.99 23.57,49.99 22.35,48.77 IC1.26 | v11.38,9.91 13.51,7.77 17.02,7.77 17.63,8.38 17.63,15.39 JAIRO-ANA.1
  Bottom 0.254: v35.15,59.44 36.68,60.96 36.68,63.55 35.15,65.08 14.73,65.08 2.54,52.88 2.54,18.75 v11.38,9.91
N$44  (via drill 0.61)
  Top 0.254: v20.83,39.47 20.83,42.22 20.07,42.98 IC1.19 | v11.99,47.4 11.68,47.7 11.68,47.85 11.07,48.46 10.16,48.46 6.81,45.11 v6.81,32 | v4.83,19.05 4.83,16.61 8.94,12.5 11.23,12.5 13.67,10.06 15.34,10.06 JAIRO-ANA.7
  Bottom 0.254: v20.83,39.47 16.1,39.47 11.99,43.59 v11.99,47.4 | v6.81,32 4.83,30.02 v4.83,19.05
N$45  (via drill 0.61)
  Top 0.254: v19.91,46.63 21.59,44.96 IC1.22 | v11.99,49.53 11.07,50.44 10.16,50.44 v7.72,48.01 | v5.28,45.57 5.28,27.28 5.74,26.82 5.74,17.22 8.33,14.63 11.68,14.63 13.67,12.65 15.19,12.65 16.41,11.43 JAIRO-ANA.5
  Bottom 0.254: v19.91,46.63 14.88,46.63 v11.99,49.53 | v5.28,45.57 v7.72,48.01
N$46
  Top 0.254: R4.2 15.65,58.37 13.06,58.37 12.75,58.06 YEL1.A
N$47  (via drill 0.61)
  Top 0.254: v13.51,28.35 13.51,31.55 16.71,34.75 16.71,41.91 IC1.16
  Bottom 0.254: v13.51,28.35 13.51,27.89 9.55,23.93 9.55,22.25 DIGITAL.5
N$48
  Top 0.254: R5.2 14.28,54.71 12.14,54.71 8.94,57.91 YEL2.A
VCC  (via drill 0.61)
  Top 0.254: R3.1 24.18,57.45 26.16,57.45 26.31,57.3 27.08,57.3 29.36,59.59 29.36,63.55 30.43,64.62 38.05,64.62 39.42,63.25 39.42,61.11 40.49,60.05 42.93,60.05 44.45,58.52 SV1.40 | 19.91,22.1 19.91,23.77 18.85,24.84 IC3.3 | 19.91,22.1 19.91,21.64 C7.1 19.91,22.1 | 37.67,23.85 36.68,24.84 IC2.3 | 37.67,23.85 37.74,23.77 37.74,21.64 C3.1 37.74,21.49 37.74,19.81 36.22,18.29 v30.89,18.29 | v22.5,22.1 19.91,22.1 | v29.06,20.12 v22.5,20.12 | SV1.32 SV1.30 SV1.28 SV1.26 SV1.24 SV1.22 SV1.20 SV1.18 SV1.16 SV1.14 SV1.12 SV1.10 SV1.8 SV1.6 SV1.4 SV1.2 | v38.2,23.93 37.74,23.93 37.67,23.85
  Bottom 0.254: v22.5,20.12 v22.5,22.1 | v30.89,18.29 v29.06,20.12 | v38.2,23.93 38.81,23.93 41.4,26.52 43.38,26.52 44.45,25.45 SV1.14 | SV1.40 44.45,57.45 43.08,56.08 43.08,52.88 42.16,51.97 41.4,51.97 40.79,51.36 40.79,50.29 41.71,49.38 43.38,49.38 44.45,48.31 SV1.32

### Text on the board
tPlace: soraduino | EnsekiTT